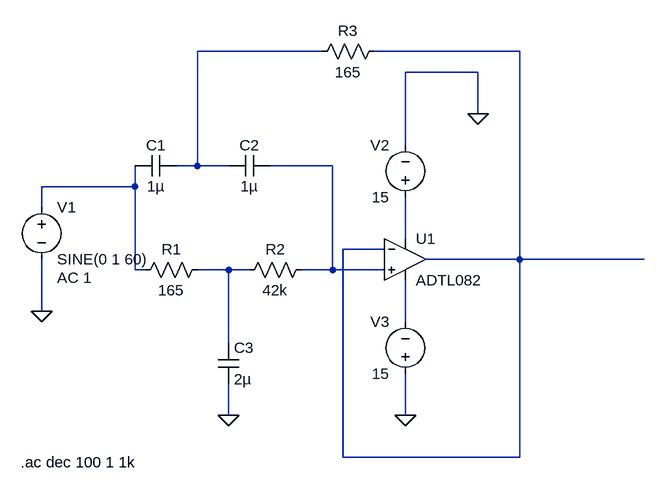
[diagram p0: schematic notxh_fltr.asc]
notxh_fltr.asc, the LTspice schematic file:
Version 4.1
SHEET 1 916 680
WIRE 416 -144 224 -144
WIRE 720 -144 496 -144
WIRE 656 -112 544 -112
WIRE 656 -48 656 -112
WIRE 544 0 544 -112
WIRE 224 32 224 -144
WIRE 224 32 192 32
WIRE 272 32 224 32
WIRE 432 32 336 32
WIRE 128 64 128 32
WIRE 128 64 -16 64
WIRE -16 96 -16 64
WIRE 544 144 544 80
WIRE 512 160 448 160
WIRE 720 176 720 -144
WIRE 720 176 576 176
WIRE 912 176 720 176
WIRE 128 192 128 64
WIRE 144 192 128 192
WIRE 272 192 224 192
WIRE 304 192 272 192
WIRE 432 192 432 32
WIRE 432 192 384 192
WIRE 512 192 432 192
WIRE -16 256 -16 176
WIRE 544 272 544 208
WIRE 272 304 272 192
WIRE 272 416 272 368
WIRE 544 416 544 352
WIRE 448 480 448 160
WIRE 720 480 720 176
WIRE 720 480 448 480
FLAG -16 256 0
FLAG 272 416 0
FLAG 656 -48 0
FLAG 544 416 0
SYMBOL voltage -16 80 R0
WINDOW 123 24 124 Left 2
WINDOW 39 0 0 Left 0
SYMATTR InstName V1
SYMATTR Value SINE(0 1 60)
SYMATTR Value2 AC 1
SYMBOL cap 192 16 R90
WINDOW 0 0 32 VBottom 2
WINDOW 3 32 32 VTop 2
SYMATTR InstName C1
SYMATTR Value 1µ
SYMBOL cap 336 16 R90
WINDOW 0 0 32 VBottom 2
WINDOW 3 32 32 VTop 2
SYMATTR InstName C2
SYMATTR Value 1µ
SYMBOL res 240 176 R90
WINDOW 0 0 56 VBottom 2
WINDOW 3 32 56 VTop 2
SYMATTR InstName R1
SYMATTR Value 165
SYMBOL res 400 176 R90
WINDOW 0 0 56 VBottom 2
WINDOW 3 32 56 VTop 2
SYMATTR InstName R2
SYMATTR Value 42k
SYMBOL cap 256 304 R0
SYMATTR InstName C3
SYMATTR Value 2µ
SYMBOL res 512 -160 R90
WINDOW 0 0 56 VBottom 2
WINDOW 3 32 56 VTop 2
SYMATTR InstName R3
SYMATTR Value 165
SYMBOL voltage 544 96 R180
WINDOW 0 24 96 Left 2
WINDOW 3 24 16 Left 2
WINDOW 123 0 0 Left 0
WINDOW 39 0 0 Left 0
SYMATTR InstName V2
SYMATTR Value 15
SYMBOL voltage 544 368 R180
WINDOW 0 24 96 Left 2
WINDOW 3 24 16 Left 2
WINDOW 123 0 0 Left 0
WINDOW 39 0 0 Left 0
SYMATTR InstName V3
SYMATTR Value 15
SYMBOL OpAmps\\ADTL082 544 112 R0
SYMATTR InstName U1
TEXT -48 488 Left 2 !.ac dec 100 1 1k

The netlist it stands for:
* notxh_fltr.asc
V1 N004 0 SINE(0 1 60) AC 1
C1 N001 N004 1µ
C2 N003 N001 1µ
R1 N006 N004 165
R2 N003 N006 42k
C3 N006 0 2µ
R3 N002 N001 165
V2 N005 0 15
V3 0 N007 15
X§U1 N003 N002 N005 N007 N002 ADTL082  ; pins In+ In- V+ V- OUT
.ac dec 100 1 1k
.lib ADI.lib
.backanno
.end